# EAGLE design pwmControl (EAGLE 8.2.1)
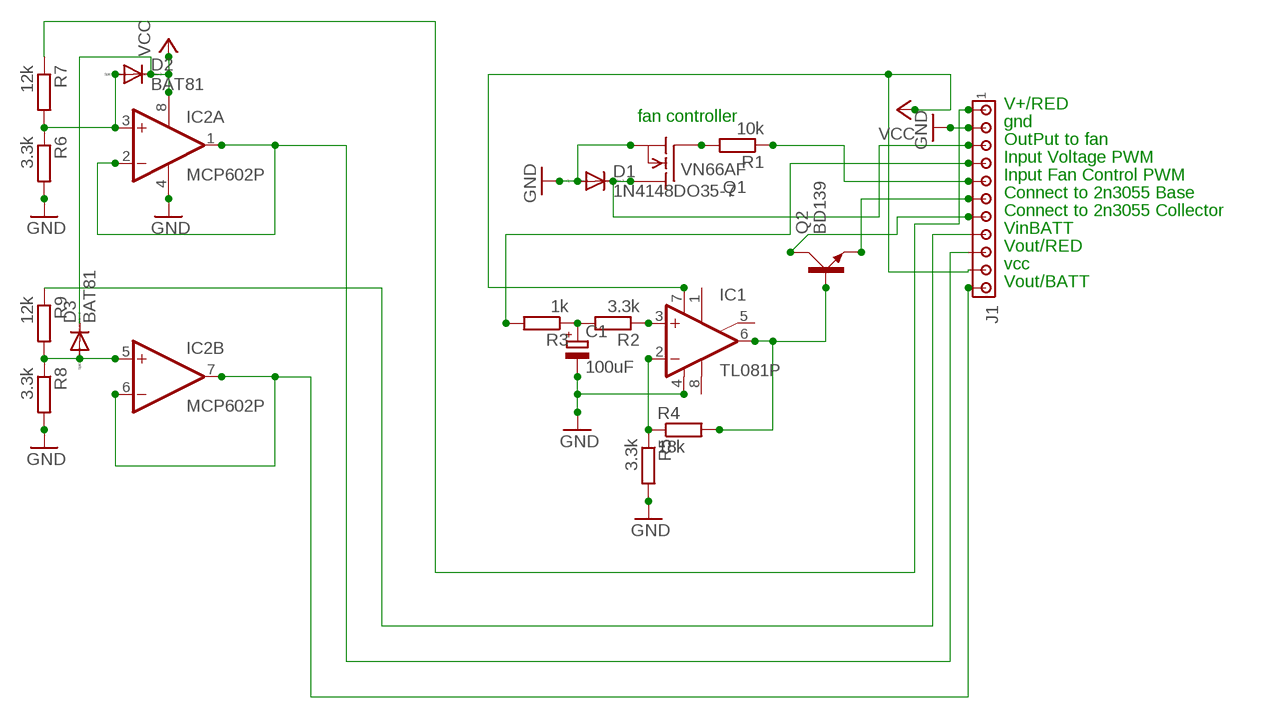
[diagram p0: schematic, sheet 1]

## Parts
C1  100uF  CPOL-EUE10-20  [EB20D]
D1  1N4148DO35-7  [DO35-7]
D2  BAT81  [DO34-7]
D3  BAT81  [DO34-7]
IC1  TL081P  [DIL08]
IC2  MCP602P  [DIL08]
J1  MTA11-156  [1X11MTA]
Q1  VN66AF  [TO202]
Q2  BD139  [TO126AV]
R1  10k  R-EU_0207/10  [0207/10]
R2  3.3k  R-EU_0207/10  [0207/10]
R3  1k  R-EU_0207/10  [0207/10]
R4  18k  R-EU_0207/10  [0207/10]
R5  3.3k  R-EU_0207/10  [0207/10]
R6  3.3k  R-EU_0207/10  [0207/10]
R7  12k  R-EU_0207/10  [0207/10]
R8  3.3k  R-EU_0207/10  [0207/10]
R9  12k  R-EU_0207/10  [0207/10]

## Nets
2N3055BASE: J1.6 Q2.E
2N3055COL: J1.7 Q2.C
GND: C1.- D1.A IC1.4(V-) IC2.4(P:V-) J1.2 Q1.1(S) R5.2 R6.2 R8.2
N$2: Q1.2(G) R1.2
N$3: IC1.3(+IN) R2.1
N$5: C1.+ R2.2 R3.1
N$6: IC1.2(-IN) R4.1 R5.1
N$7: IC1.6(OUT) Q2.B R4.2
N$10: D2.A IC2.3(A:+IN) R6.1 R7.2
N$13: D3.A IC2.5(B:+IN) R8.1 R9.2
OUTFAN: J1.5 R1.1
PWMFAN: D1.C J1.3 Q1.3(D)
PWMVOLTAGE: J1.4 R3.2
VCC: D2.C D3.C IC1.7(V+) IC2.8(P:V+) J1.10
VINBAT: J1.1 R7.1
VINRED: J1.8 R9.1
VOUTBATT: IC2.1(A:OUT) IC2.2(A:-IN) J1.9
VOUTRED: IC2.6(B:-IN) IC2.7(B:OUT) J1.11
Unconnected: IC1.1(ON1) IC1.5(ON2) IC1.8(OPT)

## Notes on the sheet
- fan controller | V+/RED
- gnd
- OutPut to fan
- Input Voltage PWM
- Input Fan Control PWM
- Connect to 2n3055 Base
- Connect to 2n3055 Collector
- VinBATT
- Vout/RED
- vcc
- Vout/BATT

## Library data of the parts
C1 = resistor:CPOL-EU: POLARIZED CAPACITOR, European symbol
D1 = diode:1N4148: DIODE high speed (Philips)
D2 D3 = diode:BAT81: DIODE barrier diode
IC1 = linear:TL081: OP AMP
IC2 = linear:MCP602: Single Op Amp 2.7V to 6.0V Single Supply CMOS Source: http://ww1.microchip.com/downloads/en/DeviceDoc/21314g.pdf
J1 = con-amp:MTA11-156: AMP connector
Q1 = transistor-fet:VN66AF: N-Channel Enhancement MOSFET 60V; 2A; 3,0Ohm
Q2 = transistor-power:BD139: NPN TRANSISTOR
R1-R9 = resistor:R-EU_: RESISTOR, European symbol

## Board
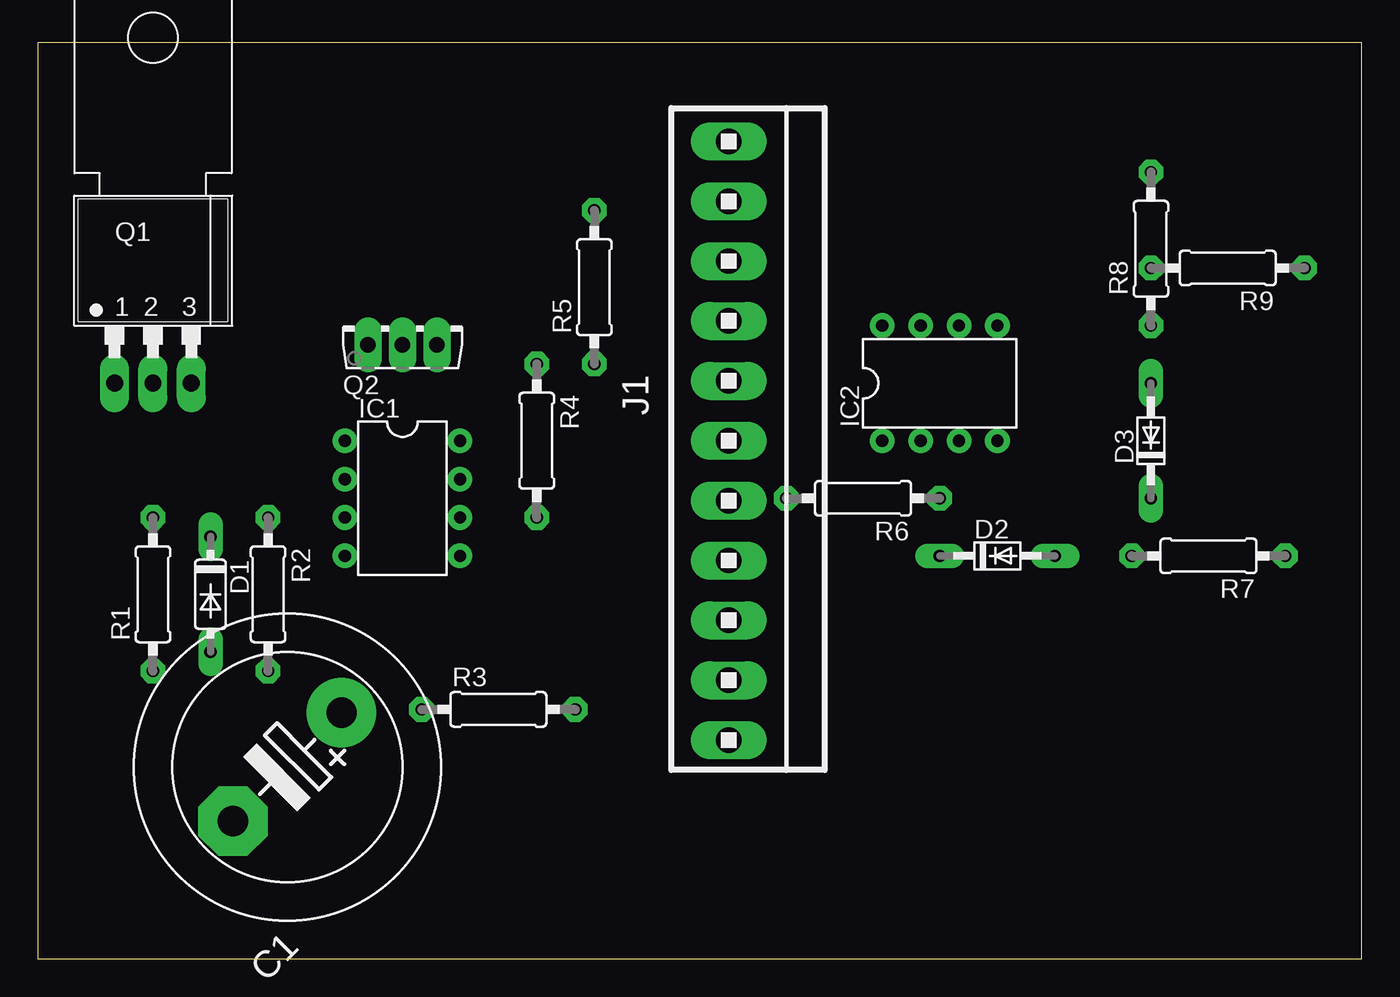
[diagram p1: board, top side]
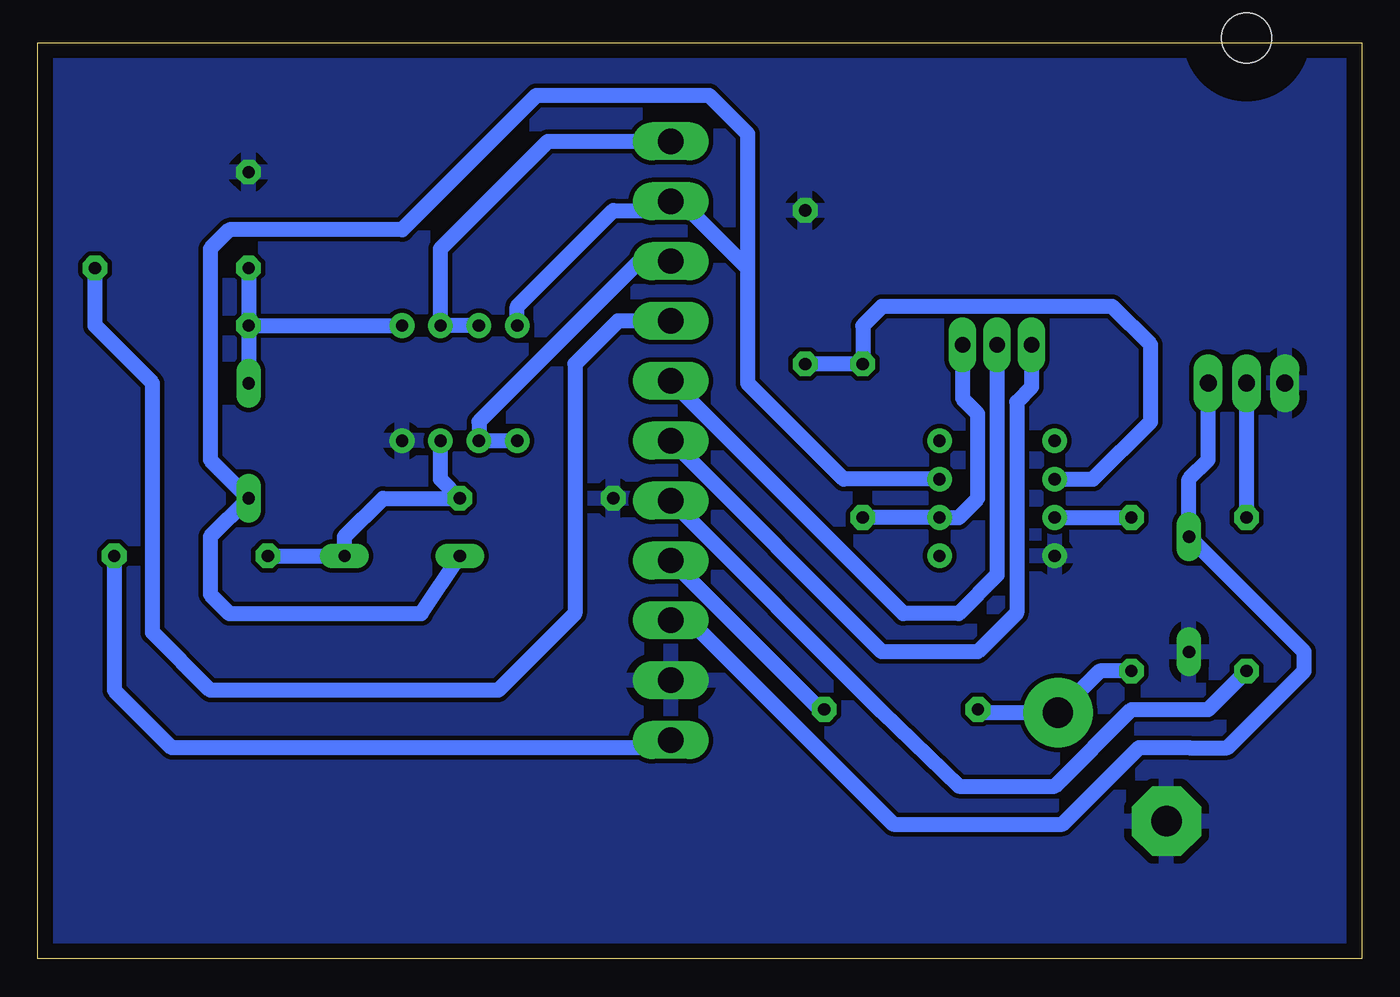
[diagram p2: board, bottom side, seen from below]

Size 87.61 x 60.63 mm. Coordinates in mm from the lower left corner, seen from the top.
Outline: 0,0 87.61,0 87.61,60.63 0,60.63 0,0
Copper layers (1*16): Top 0.035mm / dielectric 1.5mm / Bottom 0.035mm
Design rules "default *": minimum track width 10mil, minimum drill 0.8mm, track to track 0.3mm, track to pad 0.3mm, pad to pad 0.3mm, via to via 0.3mm, smd to smd 0.25mm, copper to edge 40mil, drill to drill 8mil, minimum pad ring 16mil, minimum via ring 8mil, stop-mask expansion 4mil, vias tented up to drill 0mil, thermal gap 20mil

### Footprints (pad centres in the part's own frame; a part is rotated, then mirrored left to right if it is on the bottom)
EB20D = drill 2.007 pad 4.597: + -5.08,0 | drill 2.007 pad 4.597 octagon: - 5.08,0
DO35-7 = drill 0.813 long: A 3.81,0; C -3.81,0
DO34-7 = drill 0.813 long: A 3.81,0; C -3.81,0
DIL08 = drill 0.813 pad 1.27: 1 -3.81,-3.81; 2 -1.27,-3.81; 3 1.27,-3.81; 4 3.81,-3.81; 5 3.81,3.81; 6 1.27,3.81; 7 -1.27,3.81; 8 -3.81,3.81
1X11MTA = drill 1.676 long: 1 19.812,0; 2 15.85,0; 3 11.887,0; 4 7.925,0; 5 3.962,0; 6 0,0; 7 -3.962,0; 8 -7.925,0; 9 -11.887,0; 10 -15.85,0; 11 -19.812,0
TO202 = drill 1.118 long: 1 -2.54,-5.08; 2 0,-5.08; 3 2.54,-5.08 | hole 3.302: 0,17.78
TO126AV = drill 1.016 long: B 2.286,-1.27; C 0,-1.27; E -2.286,-1.27
0207/10 = drill 0.813 octagon: 1 -5.08,0; 2 5.08,0

### Placement (x,y rotation side)
C1  16.51,12.7 225 top
D1  11.43,24.13 270 top
D2  63.5,26.67 0 top
D3  73.66,34.29 90 top
IC1  24.13,30.48 270 top
IC2  59.69,38.1 0 top
J1  45.72,34.29 270 top
Q1  7.62,43.18 0 top
Q2  24.13,41.91 0 top
R1  7.62,24.13 90 top
R2  15.24,24.13 270 top
R3  30.48,16.51 0 top
R4  33.02,34.29 270 top
R5  36.83,44.45 90 top
R6  54.61,30.48 180 top
R7  77.47,26.67 180 top
R8  73.66,46.99 90 top
R9  78.74,45.72 180 top

### Tracks (layer width: path | path; a pad name or v marks a point on that pad's centre or on a via)
2N3055BASE
  Bottom 1: J1.6 31.75,20.32 25.4,20.32 22.83,22.89 22.83,36.86 21.84,37.85 Q2.E
2N3055COL
  Bottom 1: Q2.C 24.13,25.4 26.67,22.86 30.33,22.86 J1.7
GND
  pour Bottom: 0,60.96 0,0 88.9,0 88.9,60.96
N$2
  Bottom 1: R1.2 Q1.2
N$3
  Bottom 1: IC1.3 R2.1
N$5
  Bottom 1: R2.2 17.34,19.05 C1.+ 25.18,16.29 R3.1
N$6
  Bottom 1: IC1.2 17.78,31.75 13.97,35.56 13.97,40.64 16.51,43.18 31.75,43.18 33.02,41.91 R4.1 R5.1
N$7
  Bottom 1: R4.2 IC1.6 26.67,29.21 25.4,30.48 25.4,36.07 26.42,37.08 Q2.B
N$10
  Bottom 1: R7.2 D2.A 67.31,27.94 64.77,30.48 R6.1 60.96,31.75 IC2.3
N$13
  Bottom 1: R9.2 R8.1 | R8.1 IC2.5 | R8.1 D3.A
OUTFAN
  Bottom 1: J1.5 31.75,16.36 26.67,11.43 20.32,11.43 15.24,16.51 10.16,16.51 R1.1
PWMFAN
  Bottom 1: Q1.3 10.16,33.02 11.43,31.75 D1.C 3.81,20.32 3.81,19.05 8.89,13.97 11.43,13.97 11.43,13.99 14.72,13.99 19.8,8.91 31,8.91 44.49,22.4 J1.3
PWMVOLTAGE
  Bottom 1: R3.2 35.87,16.51 J1.4
VCC
  Bottom 1: D2.C 62.23,22.86 74.93,22.86 76.2,24.13 76.2,27.94 D3.C 76.2,33.02 76.2,46.99 74.93,48.26 63.5,48.26 54.61,57.15 43.18,57.15 40.64,54.61 40.64,45.72 | IC1.7 34.29,31.75 40.64,38.1 40.64,45.72 | 40.64,45.72 44.45,49.53 45.11,49.53 J1.10 46.33,49.53 49.53,49.53 55.88,43.18 IC2.8
VINBAT
  Bottom 1: J1.1 46.23,13.97 78.74,13.97 82.55,17.78 R7.1
VINRED
  Bottom 1: J1.8 49.23,42.22 52.07,39.37 52.07,22.86 57.15,17.78 76.2,17.78 80.01,21.59 80.01,38.1 83.82,41.91 R9.1
VOUTBATT
  Bottom 1: IC2.1 IC2.2 58.42,35.56 47.8,46.18 J1.9 46.18,45.72
VOUTRED
  Bottom 1: IC2.7 IC2.6 60.96,46.99 53.85,54.1 J1.11